# EAGLE schematic Kombisensor_UP_BA (EAGLE 5.00)
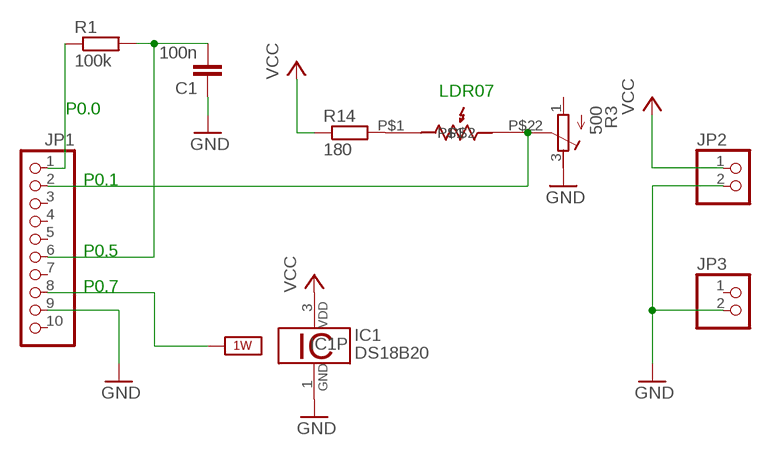
[diagram p0: schematic, sheet 1]

## Parts
C1  100n  C-EU050-024X044  [C050-024X044]
IC1  DS18B20  [TO92-]
JP1  PINHD-1X10  [1X10]
JP2  PINHD-1X2  [1X02]
JP3  PINHD-1X2  [1X02]
LDR1  LDR07  [LDR07]
R1  100k  R-EU_0207/10  [0207/10@1]
R3  500  R-TRIMM3339P  [RTRIM3339P]
R14  180  R-EU_0207/10  [0207/10@1]

## Nets
1W: JP1.8 ; supply symbol labelled 1W_SUP
GND: C1.1 IC1.1 JP1.9 JP2.2 JP3.2 R3.3(A)
N$1: C1.2 JP1.6 R1.2
N$2: JP1.2 LDR1.P$2 R3.2(S)
N$3: JP1.1 R1.1
N$4: LDR1.P$1 R14.2
VCC: IC1.3 JP2.1 R14.1
Unconnected: JP1.3 JP1.4 JP1.5 JP1.7 JP1.10 JP3.1 R3.1(E)

## Notes on the sheet
- LDR07
- P0.0
- P0.1
- P0.5
- P0.7

## Power pins joined to a net without a drawn wire
1W: IC1.2

## Library data of the parts
C1 = rcl:C-EU: CAPACITOR, European symbol
IC1 = 1wire:DS18B20: Programmable Resolution Digital Thermometer This chip provides a onewire thermosensor with approx. 0.5°C accuracy. A programmable over/undertemperure alarm is available. The precision can be set from 9..12 bits. Notes: Vdd must be applied for accurate measurements at low temperatures, as the parasite power circuit otherwise heats the sensor. If parasite power is used, Vdd has to be connected to GND. The DS1822 is a low-cost thermometer chip, the DS18S20 is similar to the DS18B20, but with 9 Bit precision only. Author: Jan Kandziora <jjj@gmx.de>
JP1 = pinhead:PINHD-1X10: PIN HEADER
JP2 JP3 = pinhead:PINHD-1X2: PIN HEADER
LDR1 = ldr:LDR07
R1 R14 = rcl:R-EU_: RESISTOR, European symbol
R3 = rcl:R-TRIMM: Trimm resistor